# EAGLE design MainBoard v1.1 (EAGLE 7.2.0)
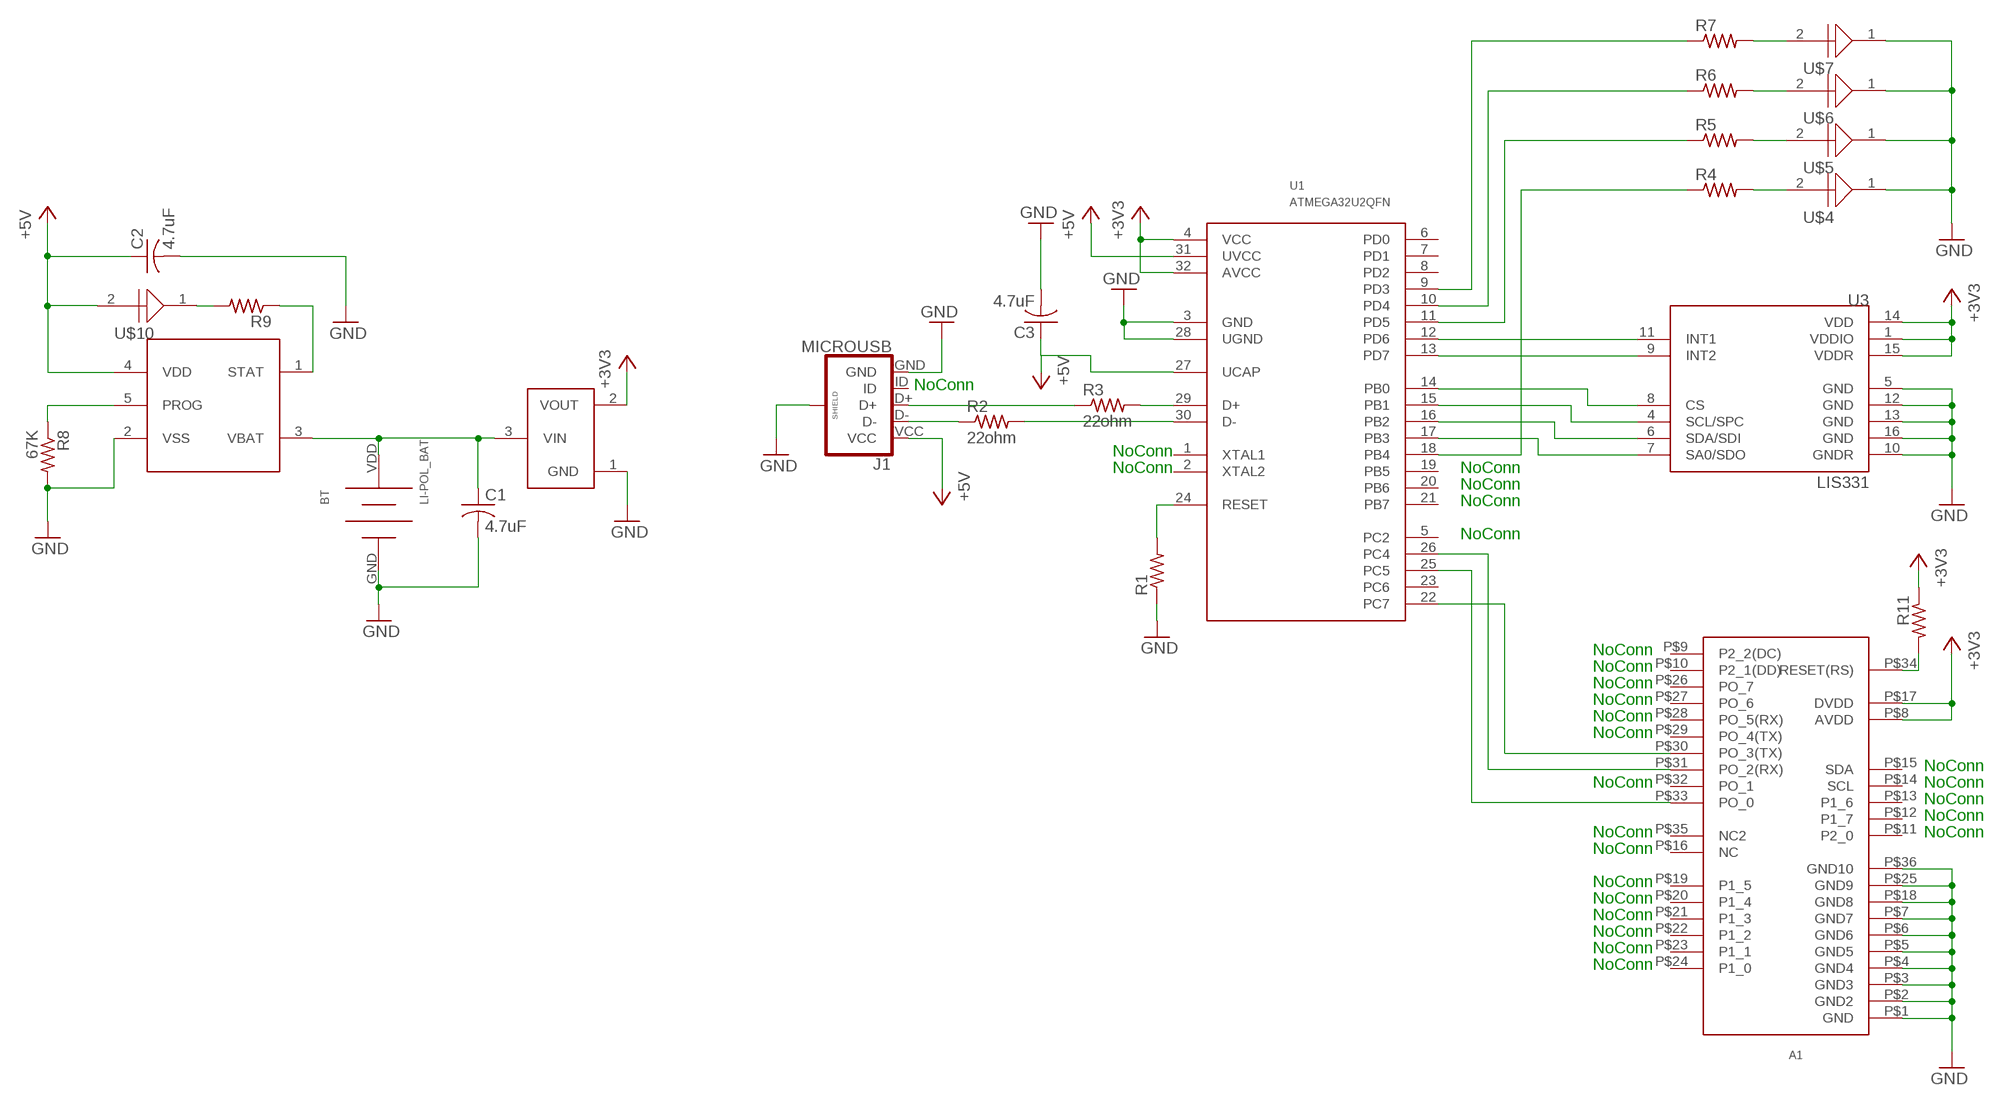
[diagram p0: schematic, sheet 1]

## Parts
A1  BLE113-A  [BLUETOOTHNS]
BT  LI-POL_BAT  [LI-POLY_28]
C1  4.7uF  C-USC0402  [C0402]
C2  4.7uF  C-USC0402  [C0402]
C3  4.7uF  C-USC0402  [C0402]
J1  MICROUSB  [MICROUSB]
R1  R-US_R0402  [R0402]
R2  22ohm  R-US_R0402  [R0402]
R3  22ohm  R-US_R0402  [R0402]
R4  R-US_R0402  [R0402]
R5  R-US_R0402  [R0402]
R6  R-US_R0402  [R0402]
R7  R-US_R0402  [R0402]
R8  67K  R-US_R0402  [R0402]
R9  R-US_R0402  [R0402]
R11  R-US_R0402  [R0402]
U1  ATMEGA32U2QFN  [QFN-32]
U2  MCP738312  [SOT23-5]
U3  LIS331  [LGA16-3MM]
U5  REGULATOR  [SOT23-3]
U$4  LED_0402  [R0402]
U$5  LED_0402  [R0402]
U$6  LED_0402  [R0402]
U$7  LED_0402  [R0402]
U$10  LED_0402  [R0402]

## Nets
+3V3: A1.P$8(AVDD) A1.P$17(DVDD) R11.1 U1.4(VCC) U1.32(AVCC) U3.1(VDDIO) U3.14(VDD) U3.15(VDDR) U5.2(VOUT)
+5V: C2.1 C3.1 J1.VCC U1.27(UCAP) U1.31(UVCC) U2.4(VDD) U$10.2
GND: A1.P$1(GND) A1.P$2(GND2) A1.P$3(GND3) A1.P$4(GND4) A1.P$5(GND5) A1.P$6(GND6) A1.P$7(GND7) A1.P$18(GND8) A1.P$25(GND9) A1.P$36(GND10) BT.GND C1.2 C2.2 C3.2 J1.GD1(SHIELD) J1.GD2(SHIELD) J1.GD3(SHIELD) J1.GD4(SHIELD) J1.GND R1.1 R8.2 U1.3(GND) U1.28(UGND) U2.2(VSS) U3.5(GND) U3.10(GNDR) U3.12(GND) U3.13(GND) U3.16(GND) U5.1(GND) U$4.1 U$5.1 U$6.1 U$7.1
N$1: R3.2 U1.29(D+)
N$2: R2.2 U1.30(D-)
N$3: R1.2 U1.24(RESET)
N$4: R4.2 U$4.2
N$5: R5.2 U$5.2
N$6: R6.2 U$6.2
N$7: R7.2 U$7.2
N$8: J1.D+ R3.1
N$9: J1.D- R2.1
N$10: BT.VDD C1.1 U2.3(VBAT) U5.3(VIN)
N$11: A1.P$34(RESET(RS)) R11.2
N$12: R8.1 U2.5(PROG)
N$13: R9.1 U2.1(STAT)
N$14: R9.2 U$10.1
N$15: U1.12(PD6) U3.11(INT1)
N$16: R4.1 U1.18(PB4)
N$17: R6.1 U1.10(PD4)
N$18: U1.15(PB1) U3.4(SCL/SPC)
N$19: U1.14(PB0) U3.8(CS)
N$20: R5.1 U1.11(PD5)
N$21: U1.16(PB2) U3.6(SDA/SDI)
N$22: U1.17(PB3) U3.7(SA0/SDO)
N$23: U1.13(PD7) U3.9(INT2)
N$25: A1.P$31(PO_2(RX)) U1.26(PC4)
N$26: A1.P$30(PO_3(TX)) U1.22(PC7)
N$27: A1.P$33(PO_0) U1.25(PC5)
N$31: R7.1 U1.9(PD3)
Unconnected: A1.P$9(P2_2(DC)) A1.P$10(P2_1(DD)) A1.P$11(P2_0) A1.P$12(P1_7) A1.P$13(P1_6) A1.P$14(SCL) A1.P$15(SDA) A1.P$16(NC) A1.P$19(P1_5) A1.P$20(P1_4) A1.P$21(P1_3) A1.P$22(P1_2) A1.P$23(P1_1) A1.P$24(P1_0) A1.P$26(PO_7) A1.P$27(PO_6) A1.P$28(PO_5(RX)) A1.P$29(PO_4(TX)) A1.P$32(PO_1) A1.P$35(NC2) J1.ID U1.1(XTAL1) U1.2(XTAL2) U1.5(PC2) U1.6(PD0) U1.7(PD1) U1.8(PD2) U1.19(PB5) U1.20(PB6) U1.21(PB7) U1.23(PC6)

## Notes on the sheet
- NoConn
- NoConn
- NoConn | NoConn
- NoConn
- NoConn
- NoConn
- NoConn
- NoConn
- NoConn
- NoConn
- NoConn
- NoConn
- NoConn
- NoConn | NoConn
- NoConn
- NoConn
- NoConn | NoConn
- NoConn
- NoConn
- NoConn
- NoConn
- NoConn
- NoConn
- NoConn

## Library data of the parts
A1 = BitFit:BLE113-A
BT = BitFit:LI-POL_BAT
C1-C3 = BitFit:C-US: CAPACITOR, American symbol
J1 = BitFit:MICROUSB
R1-R9 R11 = BitFit:R-US_: RESISTOR, American symbol
U1 = BitFit:ATMEGA32U2
U2 = BitFit:MCP738312
U3 = SparkFun-Sensors:LIS331: 3-axis 6/12/24g SPI/I2C accelerometer
U5 = BitFit:REGULATOR
U$4-U$7 U$10 = BitFit:LED_0402

## Board
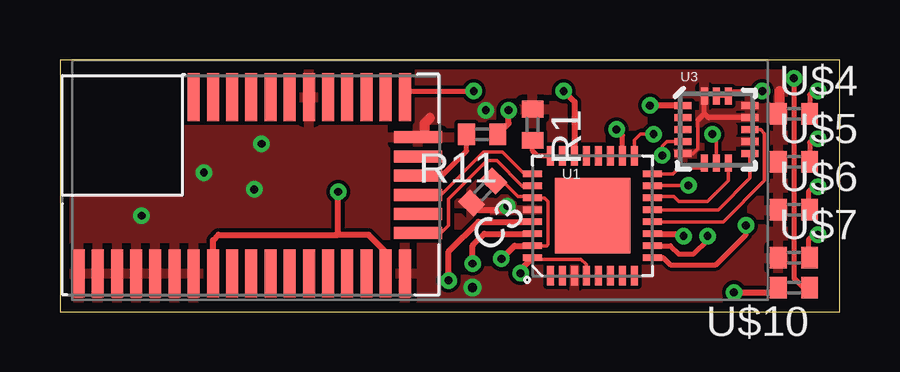
[diagram p1: board, top side]
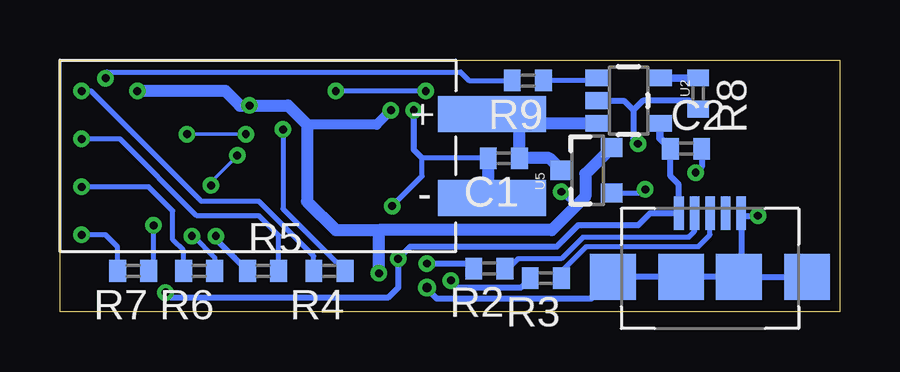
[diagram p2: board, bottom side, seen from below]

Size 32.5 x 10.5 mm. Coordinates in mm from the lower left corner, seen from the top.
Outline: 0,0 32.5,0 32.5,10.5 0,10.5 0,0
Copper layers (1*16): top 0.0356mm / dielectric 1.5011mm / Bottom 0.0356mm
Design rules "LAenPCBOrder *": minimum track width 6mil, minimum drill 13mil, track to track 6mil, track to pad 6mil, pad to pad 6mil, via to via 6mil, smd to smd 6mil, copper to edge 15mil, drill to drill 6mil, minimum pad ring 7mil, minimum via ring 7mil, stop-mask expansion 3mil, vias tented up to drill 0mil, thermal gap 10mil

### Footprints (pad centres in the part's own frame; a part is rotated, then mirrored left to right if it is on the bottom)
BLUETOOTHNS = smd 2 x 0.5: P$1 0.9,-0.675; P$2 0.9,-1.475; P$3 0.9,-2.275; P$4 0.9,-3.075; P$5 0.9,-3.875; P$6 0.9,-4.675; P$7 0.9,-5.475; P$8 0.9,-6.275; P$9 0.9,-7.075; P$10 0.9,-7.875; P$11 0.9,-8.675; P$12 0.9,-9.475; P$13 0.9,-10.275; P$14 0.9,-11.075; P$15 0.9,-11.875; P$16 0.9,-12.675; P$17 0.9,-13.475; P$18 0.9,-14.275; P$19 8.25,-5.475; P$20 8.25,-6.275; P$21 8.25,-7.075; P$22 8.25,-7.875; P$23 8.25,-8.675; P$24 8.25,-9.475; P$25 8.25,-10.275; P$26 8.25,-11.075; P$27 8.25,-11.875; P$28 8.25,-12.675; P$29 8.25,-13.475; P$30 8.25,-14.275 | smd 0.5 x 2: P$31 2.575,-14.825; P$32 3.375,-14.825; P$33 4.175,-14.825; P$34 4.975,-14.825; P$35 5.775,-14.825; P$36 6.575,-14.825
LI-POLY_28 = smd 4.5 x 1.5: GND 18,-5.75; VDD 18,-2.25
C0402 = smd 0.7 x 0.9: 1 -0.65,0; 2 0.65,0
MICROUSB = smd 0.4 x 1.4: D+ 0,4.1; D- -0.65,4.1; GND 1.3,4.1; ID 0.65,4.1; VCC -1.3,4.1 | smd 1.9 x 1.9: GD1 -4.05,1.45; GD2 -1.2,1.45; GD3 1.2,1.45; GD4 4.05,1.45
R0402 = smd 0.7 x 0.9: 1 -0.65,0; 2 0.65,0
QFN-32 = smd 0.285 x 0.8: 1 -1.75,-2.5; 2 -1.25,-2.5; 3 -0.75,-2.5; 4 -0.25,-2.5; 5 0.25,-2.5; 6 0.75,-2.5; 7 1.25,-2.5; 8 1.75,-2.5; 17 1.75,2.5; 18 1.25,2.5; 19 0.75,2.5; 20 0.25,2.5; 21 -0.25,2.5; 22 -0.75,2.5; 23 -1.25,2.5; 24 -1.75,2.5 | smd 0.8 x 0.285: 9 2.5,-1.75; 10 2.5,-1.25; 11 2.5,-0.75; 12 2.5,-0.25; 13 2.5,0.25; 14 2.5,0.75; 15 2.5,1.25; 16 2.5,1.75; 25 -2.5,1.75; 26 -2.5,1.25; 27 -2.5,0.75; 28 -2.5,0.25; 29 -2.5,-0.25; 30 -2.5,-0.75; 31 -2.5,-1.25; 32 -2.5,-1.75 | smd 3.15 x 3.15: EP 0,0
SOT23-5 = smd 0.7 x 1: 1 -0.95,-1.3; 2 0,-1.3; 3 0.95,-1.3; 4 0.95,1.3; 5 -0.95,1.3
LGA16-3MM = smd 0.7 x 0.28: 1 -1.4,1; 2 -1.4,0.5; 3 -1.4,0; 4 -1.4,-0.5; 5 -1.4,-1; 9 1.4,-1; 10 1.4,-0.5; 11 1.4,0; 12 1.4,0.5; 13 1.4,1 | smd 0.28 x 0.7: 6 -0.5,-1.4; 7 0,-1.4; 8 0.5,-1.4; 14 0.5,1.4; 15 0,1.4; 16 -0.5,1.4
SOT23-3 = smd 0.8 x 0.9: 1 -0.95,-1; 2 0.95,-1; 3 0,1.1

### Placement (x,y rotation side)
A1  0.1,0.7 90 top
BT  32.5,10.5 0 bottom
C1  14,6.4 180 bottom
C2  6.4,6.8 0 bottom
C3  17.62,4.99 225 top
J1  5.4,0 0 bottom
R1  19.7,7.8 270 top
R2  14.6,1.8 180 bottom
R3  12.25,1.4 180 bottom
R4  21.27,1.7 180 bottom
R5  24.03,1.7 0 bottom
R6  26.7,1.7 180 bottom
R7  29.45,1.7 180 bottom
R8  5.9,9.1 270 bottom
R9  12.99,9.64 180 bottom
R11  17.6,7.4 180 top
U1  22.2,4 0 top
U2  8.8,8.8 270 bottom
U3  27.36,7.59 0 top
U5  10.5,5.9 90 bottom
U$4  30.6,8.25 0 top
U$5  30.6,6.25 0 top
U$6  30.6,4.25 0 top
U$7  30.6,2.25 0 top
U$10  30.6,1 180 top

### Tracks (layer width: path | path; a pad name or v marks a point on that pad's centre or on a via)
+3V3  (via drill 0.33)
  top 0.152: 19.95,2.25 U1.32 19.76,2.19 21.73,2.19 21.95,1.96 U1.4 | U3.15 U3.14 28.07,9.2 v29.27,9.2
  top 0.254: A1.P$8 6.38,2.98 6.6,3.2 11.6,3.2 | A1.P$17 13.57,2.5 12.88,3.2 11.6,3.2 | 11.6,3.2 v11.6,5 | U1.32 19.2,1.75 v19.2,1.6 | U3.1 v24.6,8.6 | R11.1 18.7,7.85 v18.7,8.4
  Bottom 0.254: v11.6,5 11,4.4
  Bottom 0.406: v18.7,8.4 19.3,7.8 22.2,7.8
  Bottom 0.5: U5.2 10.6,5.75 10.6,4.8 11,4.4 12,3.4 19.2,3.4 | v29.27,9.2 25.6,9.2 25,8.6 25,8.59 24.99,8.6 v24.6,8.6 23,8.6 22.2,7.8 22.2,4.6 21,3.4 19.2,3.4 | v19.2,1.6 19.2,3.4
+5V  (via drill 0.33)
  top 0.152: U1.31 20.3,2.75 20.35,2.8 20.35,4.6 20.2,4.75 U1.27 19.65,4.8 19.1,4.8 18.45,5.45 C3.1
  top 0.203: 29.75,0.8 U$10.2
  top 0.254: U1.31 18.95,2.75 v18.4,2.2 | v28.1,0.8 29.75,0.8
  Bottom 0.203: C2.1 7,6.85 | 7,6.85 7,7 | 7,6.85 7,6.6
  Bottom 0.254: C2.1 7.05,5.65 6.7,5.3 J1.VCC 7.9,4.1 8.4,3.6 10.9,3.6 11.8,2.7 17.9,2.7 v18.4,2.2 18.4,1 18.8,0.6 27.9,0.6 v28.1,0.8
  Bottom 0.305: C2.1 7.5,7.25 U2.4
  Bottom 0.32: 7,6.75 C2.1
GND  (via drill 0.33, 0.38)
  top 0.152: U3.5 26.39,6.59 26.6,6.8 26.6,8
  top 0.203: 26.6,8 26.86,8.27 | 26.86,8.27 U3.16 | U3.12 27.04,8.09 26.86,8.27
  top 0.254: 18.85,4.2 v18.65,4.4 18.5,4.25 17.44,4.25 C3.2 | A1.P$36 15.2,7.55 15.2,7.6
  top 0.406: 15.43,8.07 15.2,7.85 15.2,7.6 15.2,7.4 | U$4.1 30,8.3 30,9.2
  Bottom 0.203: U5.1 8.25,4.95 v8.1,5.1 | C1.2 17.4,6.4 17.4,5.65 v18.65,4.4
  Bottom 0.254: C2.2 5.75,6.05 v6,5.8 | R8.2 6.25,8.8 8.2,8.8 8.6,8.4 | 8.6,8.4 8.6,7.2 v8.4,7 | U2.2 9,8.8 8.6,8.4 | v3.4,4 4,4 J1.GND 4.1,1.55 J1.GD3 | 17.4,6.4 17.75,6.75 v17.75,8.4 | v17.2,1 17.2,0.95 16.8,0.55 10.35,0.55 J1.GD1 J1.GD2 J1.GD3 | J1.GD3 J1.GD4
  Bottom 0.5: 14.6,5.2 14.6,4.85 BT.GND 14.65,4.9 C1.2
  pour top: 0,4.6 5.4,4.6 5.4,10.6 32.6,10.6 32.6,-0.2 0,0
N$1  (via drill 0.33)
  top 0.254: v16.2,1.3 16.2,2.51 17.44,3.75 U1.29
  Bottom 0.254: v16.2,1.3 15.9,1 13.3,1 R3.2
N$2  (via drill 0.33)
  top 0.254: v17.2,2 17.2,2.76 17.69,3.25 U1.30
  Bottom 0.203: 15.4,2 15.25,1.85 R2.2
  Bottom 0.254: 15.4,2 v17.2,2
N$3
  top 0.203: U1.24 19.9,6.5 19.7,6.7 R1.2
N$4  (via drill 0.33)
  top 0.203: 31.45,8.25 U$4.2 31.25,9.05 31.4,9.2 v31.6,9.2
  Bottom 0.203: R4.2 21.92,2.32 24.2,4.6 26.6,4.6 31.2,9.2 v31.6,9.2
N$5  (via drill 0.33)
  top 0.203: U$5.2 31.25,7.05 31.4,7.2 v31.6,7.2
  Bottom 0.203: R5.2 23.38,3.18 24.2,4 26.8,4 30,7.2 v31.6,7.2
N$6  (via drill 0.33)
  top 0.203: v31.6,5.2 31.4,5.2 31.2,5 31.2,4.3 U$6.2
  Bottom 0.203: R6.2 27.35,2.55 27.8,3 27.8,4.2 28.8,5.2 v31.6,5.2
N$7  (via drill 0.33)
  top 0.203: v31.6,3.2 31.4,3.2 31.2,3 31.2,2.3 U$7.2
  Bottom 0.203: R7.2 30.1,2.7 30.6,3.2 v31.6,3.2
N$8
  Bottom 0.203: J1.D+ 5.4,3.2 5.9,2.7 10.57,2.7 11.6,1.67 R3.1
N$9
  Bottom 0.203: R2.1 13.8,1.8 13.4,2.2 11.6,2.2 10.7,3.1 6.3,3.1 6.05,3.35 J1.D-
N$10
  Bottom 0.5: 13.4,8 14.25,8 BT.VDD | U2.3 13.6,7.85 | 13.6,7.85 14.1,7.85 BT.VDD | 14.65,8.1 BT.VDD | 13.6,7.85 13.35,7.6 C1.1 12.1,6.4 U5.3
N$11
  top 0.203: A1.P$34 15.93,5.67 16.95,6.7 R11.2
N$12
  Bottom 0.32: R8.1 U2.5
N$13
  Bottom 0.152: U2.1 10.15,9.8 10.23,9.72
  Bottom 0.203: 10.23,9.72 10.31,9.64 R9.1
N$14  (via drill 0.33)
  top 0.203: v30.6,9.73 30.6,1.4 31,1 U$10.1
  Bottom 0.203: R9.2 15.44,9.64 15.8,10 30.53,10 30.6,9.93 v30.6,9.73
N$15
  top 0.152: U1.12 27.66,3.75 29.37,5.46 29.37,7.43 29.21,7.59 U3.11
N$16  (via drill 0.33)
  top 0.203: U1.18 23.45,7.35 v23.2,7.6
  Bottom 0.203: v23.2,7.6 23.2,4.28 R4.1
N$17  (via drill 0.33)
  top 0.203: U1.10 25.45,2.75 25.8,2.4 26.4,2.4 27,3 v27,3.15
  Bottom 0.203: R6.1 26.05,2.25 26.95,3.15 v27,3.15
N$18  (via drill 0.33)
  top 0.152: 24.8,5.2 24.75,5.2 arc-90 U1.15 24.71,5.26 v26.2,5.26 | U3.4 25.29,7.09 25.11,6.91 v25.11,6.51
  Bottom 0.152: v26.2,5.26 26.2,5.4 25.11,6.49 v25.11,6.51
N$19
  top 0.152: U1.14 24.75,4.8 25.6,4.8 25.81,4.59 26.99,4.59 27.86,5.46 U3.8 27.86,5.92
N$20  (via drill 0.33)
  top 0.203: 25.95,3.25 26,3.2 v26,3.15
  top 0.254: U1.11 25.95,3.25
  Bottom 0.254: v26,3.15 26,3.02 R5.1
N$21
  top 0.152: 24.75,5.8 U1.16 25.55,5.75 25.8,6 26.8,6
  top 0.203: 26.8,6 26.86,6.07 U3.6
N$22  (via drill 0.33)
  top 0.152: U1.17 24,6.55 24,6.6 | 23.95,6.75 U1.17 | U3.7 27.36,7.24 v27.2,7.4 | v24.75,7.4 24.2,7.4 23.95,7.15 U1.17
  Bottom 0.152: v27.2,7.4 v24.75,7.4
N$23
  top 0.152: U1.13 27.45,4.25 28.77,5.57 U3.9
N$25
  top 0.152: U1.26 19.27,5.25 18.22,6.3 17.8,6.3 16.2,4.71 16.2,3.6 15.88,3.27 A1.P$31
N$26  (via drill 0.33)
  top 0.203: 14.43,9 14.62,9.2 v17.25,9.2
  top 0.254: A1.P$30 14.43,9 | U1.22 21.45,8.75 v21,9.2
  Bottom 0.203: v17.25,9.2 v21,9.2
N$27
  top 0.152: U1.25 19.37,5.75 18.45,6.67 17.66,6.67 15.88,4.88 A1.P$33
N$31  (via drill 0.33)
  top 0.203: U1.9 25.15,2.25 25.45,1.95 27.35,1.95 28.6,3.2 v28.6,3.6
  Bottom 0.203: R7.1 28.6,1.9 v28.6,3.6